# Altium schematic sheet SCB_vongcochopet.schdoc
size A
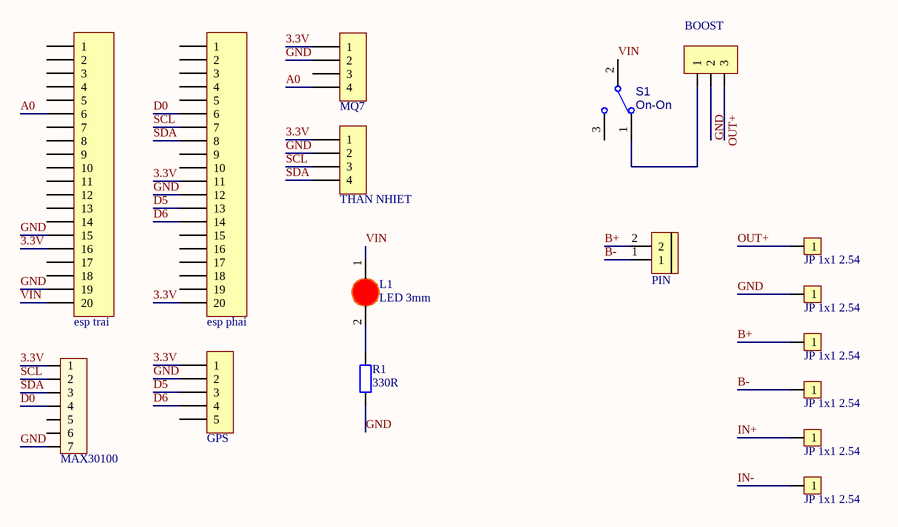
[diagram p0: SCB_vongcochopet.schdoc]

## Parts
H1  MQ7  [Header DT 4P_2.54]
H2  THAN NHIET  [Header DT 4P_2.54]
H3  GPS  [Header DT 5P_2.54]
H4  MAX30100  [Header DT 7P_2.54]
JP1  esp trai  [JP 1x20 CT]
JP2  esp phai  [JP 1x20 CT]
JP3  BOOST  [JP 1x3 DT]
JP4  JP 1x1 2.54  [JP 1x1 DT]
JP5  JP 1x1 2.54  [JP 1x1 DT]
JP6  JP 1x1 2.54  [JP 1x1 DT]
JP7  JP 1x1 2.54  [JP 1x1 DT]
JP8  JP 1x1 2.54  [JP 1x1 DT]
JP9  JP 1x1 2.54  [JP 1x1 DT]
KF1  PIN  [Con 2 KF301 5.08]
L1  LED 3mm  [LED-3MM-RED]
R1  330R  [tro vach 1/4w]
S1  ON-ON  [SWITCH_SPDT_SLIDER]

## Nets
3.3V: H1.1 H2.1 H3.1 H4.1 JP1.16 JP2.11 JP2.20
A0: H1.4 JP1.6
B+: JP6.1 KF1.2
B-: JP7.1 KF1.1
D0: H4.4 JP2.6
D5: H3.3 JP2.13
D6: H3.4 JP2.14
GND: H1.2 H2.2 H3.2 H4.7 JP1.15 JP1.19 JP2.12 JP3.2 JP5.1 R1.1
IN+: JP8.1
IN-: JP9.1
OUT+: JP3.3 JP4.1
SCL: H2.3 H4.2 JP2.7
SDA: H2.4 H4.3 JP2.8
VIN: JP1.20 L1.1(A) S1.2
NetJP3_1: JP3.1 S1.1
NetL1_2: L1.2(K) R1.2

Not connected (* = marked no-connect by the designer): H1 3; H3 5; H4 5 6; JP1 1 2 3 4 5 7 8 9 10 11 12 13 14 17 18; JP2 1 2 3 4 5 9 10 15 16 17 18 19; S1 3

## Library data of the parts
H1 H2 = Header 4P 2.54 Duc Thang: Cắm; Ten_Linh_Kien: Header 4P XH2.54-4P Đực Thẳng; Don_Vi: Con; Ma_Hang: MH001285; Chung_Loai: Cắm
H3 = Header 5P 2.54 Duc Thang: Cắm; Ten_Linh_Kien: Header 5P XH2.54-5P Đực Thẳng; Don_Vi: Con; Ma_Hang: MH001298; Chung_Loai: Cắm
H4 = Header 7P 2.54 Duc Thang: Cắm; Ten_Linh_Kien: Header 7P XH2.54-7P Đực Thẳng; Don_Vi: Con; Ma_Hang: MH003369; Chung_Loai: Cắm
JP1 JP2 = JP 1x20 2.54 Cai Thang: Cắm; Ten_Linh_Kien: Jump Đơn Cái 2.54MM 1x20P Thẳng; Don_Vi: Con; Ma_Hang: MH004006; Ghi_Chu: *; Kieu_Chan: *; Chung_Loai: Cắm
JP3 = JP 1x3 2.54 Duc Thang: Cắm; Ten_Linh_Kien: Jump Đơn Đực 2.54MM 1x40P Thẳng 11MM; Don_Vi: Con; Ma_Hang: MH000903; Ghi_Chu: *; Kieu_Chan: *; Chung_Loai: Cắm
JP4-JP9 = JP 1x1 2.54 Duc Thang: Cắm; Ten_Linh_Kien: Jump Đơn Đực 2.54MM 1x40P Thẳng 11MM; Don_Vi: Con; Ma_Hang: MH000903; Ghi_Chu: *; Kieu_Chan: *; Chung_Loai: Cắm
KF1 = CON 2 KF301: Cắm; Ma_Hang: MH000987; Ten_Linh_Kien: CON 2 KF301-2P 5.08MM Xanh Dương; Don_Vi: Con; Chung_Loai: Cắm; Ghi_Chu: *; Kieu_Chan: *
L1 = LED 3mm Do: Cắm; Don_Vi: Con; Ma_Hang: MH003892; Ten_Linh_Kien: Led 3MM Phủ Đỏ (10c); Ghi_Chu: *; Kieu_Chan: *; Chung_Loai: Cắm
R1 = Tro Vach 1/4W 5% 330R: Cắm; Don_Vi: Con; So_Chan: 2; Ten_Linh_Kien: Trở Vạch 1/4W 5% 330R; Ma_Hang: MH007436; Chung_Loai: Cắm; Kieu_Chan: *
S1 = SW_THD_SPDT_On-On: Switch THD vertical toggle SPDT; Manufacturer 1: TE Connectivity; Manufacturer Part Number 1: SLS121PC04; Contact Rating @ Voltage: 0.25A @ 125VAC; SCDType: spec; Circuit: SPDT; Mounting Type: PCB mount; Supplier 1: Digi-Key; Supplier Part Number 1: 450-1598-ND; Switch Function: On-On